# Altium schematic sheet Input_power.SchDoc: Input_Power
size A4; DrawnBy: Project_Vega_Team; Revision: 1; SheetNumber: 2; SheetTotal: 7
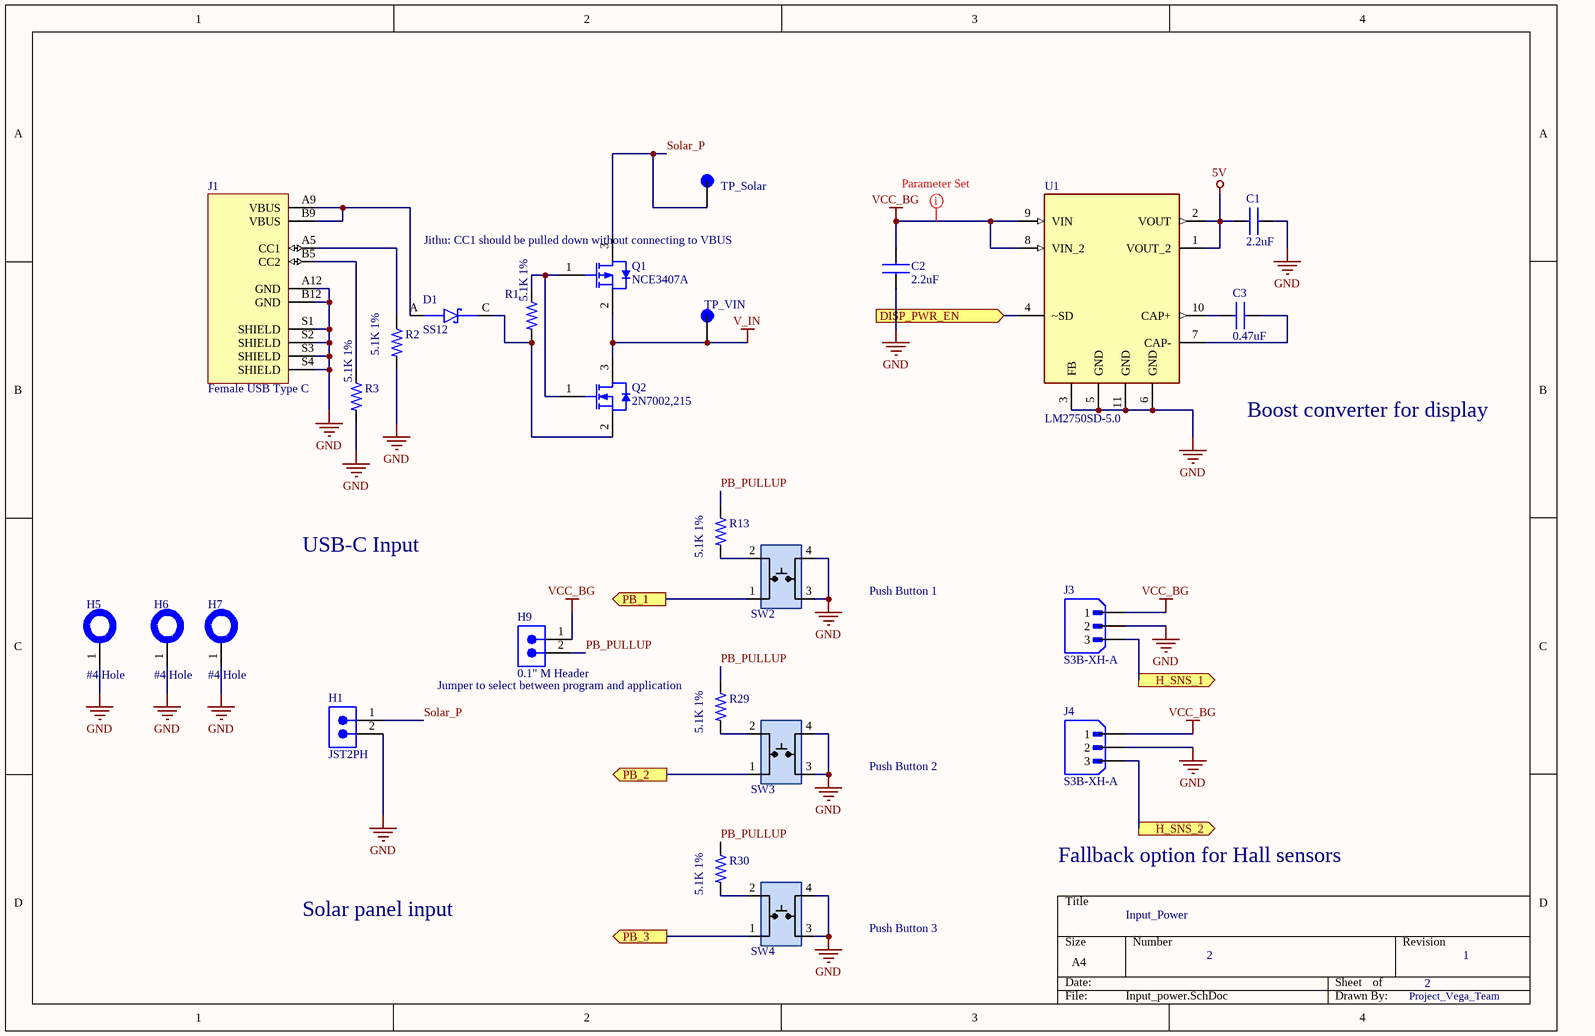
[diagram p0: Input_power.SchDoc]

## Parts
C1  2.2uF  [CAP_0603_1MM]
C2  2.2uF  [CAP_0603_1MM]
C3  0.47uF  [CAP_0603_1MM]
D1  SS12  [DIOM4427X270N]
H1  JST2PH  [JST_B2B-PH-K-S(LF)(SN)]
H5  #4 Hole  [HOLE_#4]  (no BOM)
H6  #4 Hole  [HOLE_#4]  (no BOM)
H7  #4 Hole  [HOLE_#4]  (no BOM)
H9  0.1" M Header  [2-PIN_MALE_HEADER_01-IN]
J1  Female USB Type C  [GCT_USB4125-GF-A_REVA2]
J3  S3B-XH-A  [JST_S3B-XH-A]
J4  S3B-XH-A  [JST_S3B-XH-A]
Q1  NCE3407A  [NCEP-SOT23-3_M]
Q2  2N7002,215  [NXP-SOT23-3_V]
R1  5.1K 1%  [RES_0603_1608X06]
R2  5.1K 1%  [RES_0603_1608X06]
R3  5.1K 1%  [RES_0603_1608X06]
R13  5.1K 1%  [RES_0603]
R29  5.1K 1%  [RES_0603]
R30  5.1K 1%  [RES_0603]
SW2  TL3305AF160QG  [Switch_JLC]  (value not drawn)
SW3  TL3305AF160QG  [Switch_JLC]  (value not drawn)
SW4  TL3305AF160QG  [Switch_JLC]  (value not drawn)
TP_Solar  Test_point  [1]  (value not drawn)
TP_VIN  Test_point  [1]  (value not drawn)
U1  LM2750SD-5.0  [LM2750_DFN300X300X80-11N]

## Ports
DISP_PWR_EN (in, see Principal_Node[2D]), H_SNS_1 (out, see Principal_Node[2D]), H_SNS_2 (out, see Principal_Node[2D]), PB_1 (out, see Principal_Node[2C]), PB_2 (out, see Principal_Node[2C]), PB_3 (out, see Principal_Node[2D])

## Nets
5V: C1.2 U1.1(VOUT_2) U1.2(VOUT)
GND: C1.1 C2.1 H1.2 H5.1 H6.1 H7.1 J1.A12(GND) J1.B12(GND) J1.S1(SHIELD) J1.S2(SHIELD) J1.S3(SHIELD) J1.S4(SHIELD) J3.2 J4.2 R2.2 R3.2 SW2.3 SW2.4 SW3.3 SW3.4 SW4.3 SW4.4 U1.3(FB) U1.5(GND) U1.6(GND) U1.11(GND)
V_IN: Q1.2(SOURCE) Q2.3(D) TP_VIN.TP(VIN)
VCC_BG: C2.2 H9.1 J3.1 J4.1 U1.8(VIN_2) U1.9(VIN)
DISP_PWR_EN: U1.4(~SD) ; port DISP_PWR_EN
H_SNS_1: J3.3 ; port H_SNS_1
H_SNS_2: J4.3 ; port H_SNS_2
PB_1: SW2.1 ; port PB_1
PB_2: SW3.1 ; port PB_2
PB_3: SW4.1 ; port PB_3
PB_PULLUP: H9.2 R13.1 R29.1 R30.1
Solar_P: H1.1 Q1.3(DRAIN) TP_Solar.TP(Solar)
NetC3_1: C3.1 U1.7(CAP-)
NetC3_2: C3.2 U1.10(CAP+)
NetD1_A: D1.A J1.A9(VBUS) J1.B9(VBUS)
NetD1_C: D1.C Q2.2(S) R1.2
NetJ1_A5: J1.A5(CC1) R2.1
NetJ1_B5: J1.B5(CC2) R3.1
NetQ1_1: Q1.1(GATE) Q2.1(G) R1.1
NetR13_2: R13.2 SW2.2
NetR29_2: R29.2 SW3.2
NetR30_2: R30.2 SW4.2

## Layout directives
rule Width Constraint [Pref Width = 20mil    Min Width = 6mil    Max Width = 20mil]: VCC_BG

## Notes on the sheet
- (near Q1) Jithu: CC1 should be pulled down without connecting to VBUS
- Boost converter for display
- USB-C Input
- Push Button 1
- (near R29) Jumper to select between program and application
- Push Button 2
- Solar panel input
- Fallback option for Hall sensors
- Push Button 3

## Library data of the parts
C1 = GRM188R61A226ME15D: Manufacturer: Murata; Capacitance: 22 uF; Voltage Rating DC: 10 VDC; Dielectric: X5R; Tolerance: 20 %; Brand: Murata Electronics; Type: Voltage and Temperature Derating Recommended Product; Unit Weight: 0.000222 oz; Supplier 1: Digi-Key; Supplier Part Number 1: 490-10476-1-ND; Manufacturer Part Number: GRM188R61A226ME15D; Stock 1: 849458; Pricing 1: 1=0.33, 10=0.226, 50=0.1506, 100=0.1279, 500=0.0903, 1000=0.079 (USD); Product Category: Multilayer Ceramic Capacitors MLCC - SMD/SMT; RoHS: True; Case Code - in: 0603; Case Code - mm: 1608; Height: 0.8 mm; Maximum Operating Temperature: + 85 C; Minimum Operating Temperature: - 55 C; Product: General Type MLCCs; Series: GRM; Packaging: Reel; Length: 1.6 mm; Package / Case: 0603 (1608 metric); Factory Pack Quantity: 4000; Termination Style: SMD/SMT; Width: 0.8 mm; ComponentLink1URL: http://www.farnell.com/datasheets/2047978.pdf?src-supplier=Element14; ComponentLink1Description: http://www.farnell.com/datasheets/2047978.pdf?src-supplier=Element14
C2 C3 = GRM188R61A226ME15D: CAP CER 22UF 10V X5R 0603; Manufacturer: Murata; Voltage Rating DC: 10 VDC; Tolerance: 20 %; Brand: Murata Electronics; Type: Voltage and Temperature Derating Recommended Product; Unit Weight: 0.000222 oz; Supplier 1: Digi-Key; Supplier Part Number 1: 490-10476-1-ND; Manufacturer Part Number: GRM188R61A226ME15D; Stock 1: 849458; Pricing 1: 1=0.33, 10=0.226, 50=0.1506, 100=0.1279, 500=0.0903, 1000=0.079 (USD); Product Category: Multilayer Ceramic Capacitors MLCC - SMD/SMT; RoHS: True; Capacitance: 22 uF; Dielectric: X5R; Case Code - in: 0603; Case Code - mm: 1608; Height: 0.8 mm; Maximum Operating Temperature: + 85 C; Minimum Operating Temperature: - 55 C; Product: General Type MLCCs; Series: GRM; Packaging: Reel; Length: 1.6 mm; Package / Case: 0603 (1608 metric); Factory Pack Quantity: 4000; Termination Style: SMD/SMT; Width: 0.8 mm; ComponentLink1URL: http://www.farnell.com/datasheets/2047978.pdf?src-supplier=Element14; ComponentLink1Description: http://www.farnell.com/datasheets/2047978.pdf?src-supplier=Element14
D1 = SS12: DIODE SCHOTTKY 20V 1A DO214AC; MF: Klein Tools,; SnapEDA_Link: https://www.snapeda.com/parts/SS12/Klein%20Tools,%20Inc./view-part/2177644/?ref=snap; MP: SS12; Check_prices: https://www.snapeda.com/parts/SS12/Klein%20Tools,%20Inc./view-part/2177644/?ref=eda; Price: None; Purchase-URL: https://pricing.snapeda.com/search/part/SS12/?ref=eda; Value: *; Availability: Good; Package: DO-214AC-214 ON Semiconductor; ComponentLink1Description: digikey; ComponentLink1URL: https://www.digikey.com/en/products/detail/onsemi/SS12/1049858
H1 = JST2PH: Connector Header Through Hole 2 position 0.079" (2.00mm); Manufacturer: JST; Manufacturer Part Number: B2B-PH-K-S; Supplier: Digi-Key; Supplier Part Number: 455-1704-ND; RoHS: Yes; Category: Connectors; Stock: 1077617; Pricing: 1=0.19, 10=0.147, 100=0.1088, 500=0.09006, 1000=0.0788, 5000=0.06754, 10000=0.06567 (USD); ComponentLink1URL: https://datasheet.ciiva.com/6905/phseries-6905929.pdf?src-supplier=Digi-Key; ComponentLink1Description: https://datasheet.ciiva.com/6905/phseries-6905929.pdf?src-supplier=Digi-Key
H5-H7 = HOLE_#4
H9 = PRPC002SAAN-RC: CONN HEADER VERT 2POS 2.54MM; Manufacturer: Sullins; Connector Type: Header, Unshrouded, Breakaway; Number of Positions: 2; Number of Positions Loaded: All; Pitch: 0.100" (2.54mm); Online Catalog: 0.100" (2.54mm) Pitch Connector Headers; Other Names: S9510E-02  S9510E-02-ND; Supplier 1: Digi-Key; Manufacturer Part Number: PRPC002SAAN-RC; Stock 1: 42739; Pricing 1: 1=0.08, 10=0.073, 25=0.054, 50=0.0464, 100=0.0449, 250=0.0387, 500=0.0372 (USD); Standard Package: 1; Category: Connectors, Interconnects; Family: Rectangular Connectors - Headers, Male Pins; Series: -; Packaging: Bulk; Contact Type: Male Pin; Number of Rows: 1; Row Spacing: -; Contact Mating Length: 0.230" (5.84mm); Mounting Type: Through Hole; Termination: Solder; Fastening Type: -; Features: -; Contact Finish: Gold; Contact Finish Thickness: Flash; Color: Black; ComponentLink1URL: https://media.digikey.com/PDF/Data%20Sheets/Sullins%20PDFs/xRxCzzzSxxN-RC_ST_11635-B.pdf?src-supplier=Digi-Key; ComponentLink1Description: https://media.digikey.com/PDF/Data%20Sheets/Sullins%20PDFs/xRxCzzzSxxN-RC_ST_11635-B.pdf?src-supplier=Digi-Key; Supplier Part Number 1: S1011EC-02-ND
J1 = USB-C Power Connector: USB Connector, 24 Contact(s), Female, Right Angle, Solder Terminal, Locking, Receptacle; Manufacturer Part Number: USB4125-GF-A_REVA2; Manufacturer: Global Connector Technology; Package: None; Availability: Unavailable; Value: *; Price: None; Supplier: Digikey; Supplier Part Number: 2073-USB4125-GF-ACT-ND; RoHS: No; Category: Connectors; Stock: 9026; Pricing: 1=0.8, 10=0.609, 25=0.5472, 50=0.505, 100=0.4667, 250=0.42128, 500=0.3905, 1000=0.36254, 2000=0.3372, 3000=0.32348, 5000=0.3073, 7000=0.29727, 10000=0.28716, 25000=0.2675 (USD); Pins: 6; Gender: Receptacle; Orientation: Horizontal; ComponentLink1URL: https://datasheet.octopart.com/USB4125-GF-A-Global-Connector-Technology-datasheet-148864632.pdf?src-supplier=Future+Electronics; ComponentLink1Description: https://datasheet.octopart.com/USB4125-GF-A-Global-Connector-Technology-datasheet-148864632.pdf?src-supplier=Future+Electronics; ComponentLink2URL: https://datasheet.octopart.com/USB4125-GF-A-GCT-datasheet-166929326.pdf?src-supplier=SOS+electronic; ComponentLink2Description: https://datasheet.octopart.com/USB4125-GF-A-GCT-datasheet-166929326.pdf?src-supplier=SOS+electronic
J3 J4 = S3B-XH-A: Board Connector, 3 Contact(s), 1 Row(s), Male, Right Angle, Solder Terminal; Manufacturer: JST; MF: JST Sales; MP: B3B-XH-A(LF)(SN); Number of Contacts: 3; SnapEDA_Link: https://www.snapeda.com/parts/B3B-XH-A(LF)(SN)/JST+Sales+America+Inc./view-part/?ref=snap; Package: None; Value: *; Check_prices: https://www.snapeda.com/parts/B3B-XH-A(LF)(SN)/JST+Sales+America+Inc./view-part/?ref=eda; Supplier 1: Digikey; Supplier Part Number 1: 455-S3B-XH-A-ND; Supplier: Digikey; Supplier Part Number: 455-S3B-XH-A-ND; Manufacturer Part Number: S3B-XH-A; RoHS: Yes; Category: FFC / FPC; Stock: 168930; Pricing: 1=0.19, 10=0.146, 100=0.1118, 500=0.09304, 1000=0.08614, 5000=0.07248, 10000=0.06971 (USD); Contact Plating: Tin; Contact Material: Brass; Number of Rows: 1; Termination: Through Hole; Gender: Male; Series: XH; Reach SVHC Compliant: No; ComponentLink1URL: https://datasheet.ciiva.com/8052/621903-8052222.pdf?src-supplier=Element14; ComponentLink1Description: https://datasheet.ciiva.com/8052/621903-8052222.pdf?src-supplier=Element14
Q1 = CMP-013-00018-3: P-Channel Enhancement Mode Power MOSFET, 30 V, 4.3 A, - 55 to 150 degC, 3-Pin SOT23, RoHS, Tape and Reel; Manufacturer: NCE Power; Datasheet Version: Rev. 1.1, 07/2014; Case/Package: SOT23-3; Mounting Technology: SM; Datasheet URL: http://www.ncepower.com/Upload/MOSFET/mos1/55vpmos/NCE3407Adatasheet-17275285683.pdf; Package Reference: SOT23-3; Package Description: 3-Pin Small Outline Transistor, Body 2.9 x 1.3 mm, Pitch 0.95 mm; RoHS Compliant: Unknown
Q2 = CMP-013-00011-4: N-channel Trench MOSFET, 60 V, 300 mA, -65 to 150 degC, 3-Pin SOT-23 (TO-236AB), RoHS, Tape and Reel; Manufacturer: NXP Semiconductors; Elements: 1; Power: 830mW; Max Dual Supply Voltage: 60V; Rds On Max: 5Ohm; Package Version: Feb-16; Nominal Vgs: 2V; Input Capacitance: 50pF; RoHS Compliant: True; Datasheet URL: http://www.nxp.com/documents/data_sheet/2N7002.pdf; Packaging: TapeandReel; Case/Package: TO-236-3; Package Reference: SOT23-3; Max Operating Temperature: 150°C; Pins: 8; Mounting Technology: SM; Package Quantity: 1; Datasheet Version: Rev. 7, 09/2011; Nominal Dual Supply Voltage: 60V; Min Operating Temperature: -65°C; Package Description: 3-Pin Small Outline Transistor, Body 1.3 x 2.9 mm, Pitch 0.95 mm; Vds Max: 60V
R1 R3 R13 R29 R30 = RC0603FR-07316KL: SMD Chip Resistor, 5.1KOhm, ± 1%, 100 mW, 0603 [1608 Metric], Thick Film, General Purpose; Manufacturer: Yageo; Value: 316kR; Power Rating: 100mW; Voltage Rating: 50V; Temperature Coefficient: 100ppm/°C; Supplier: Digikey; Supplier Part Number: 311-316KHRCT-ND; Manufacturer Part Number: RC0603FR-07316KL; RoHS: Yes; Category: Chip SMD Resistors; Stock: 149463; Pricing: 1=0.1, 10=0.019, 50=0.0112, 100=0.0093, 500=0.00622, 1000=0.00532 (USD); Mounting Technology: Surface Mount; Case/Package: 0603; Case Code (Imperial): 0603; Case Code (Metric): 1608; Min Operating Temperature: -55°C; Max Operating Temperature: 155°C; Tolerance: 1%; Packaging: Tape and Reel; Termination: SMD/SMT; Number of Terminations: 2; Max Power Dissipation: 100mW; Voltage Rating (DC): 50V; Features: Moisture Resistant; Series: RC; Lead Free: Lead Free; RoHS Compliant: Yes; ComponentLink1URL: https://datasheet.ciiva.com/2454/pyu-r-int-thick-7-2454966.pdf?src-supplier=Digikey; ComponentLink1Description: https://datasheet.ciiva.com/2454/pyu-r-int-thick-7-2454966.pdf?src-supplier=Digikey; ComponentLink2URL: https://datasheet.ciiva.com/2454/pyu-r-int-thick-7-2454967.pdf?src-supplier=Digikey; ComponentLink2Description: https://datasheet.ciiva.com/2454/pyu-r-int-thick-7-2454967.pdf?src-supplier=Digikey; ComponentLink3URL: https://datasheet.ciiva.com/2454/pyu-r-int-thick-7-2454968.pdf?src-supplier=Digikey; ComponentLink3Description: https://datasheet.ciiva.com/2454/pyu-r-int-thick-7-2454968.pdf?src-supplier=Digikey
R2 = RC0603FR-07316KL: SMD Chip Resistor, 316 kOhm, ± 1%, 100 mW, 0603 [1608 Metric], Thick Film, General Purpose; Manufacturer: Yageo; Value: 316kR; Power Rating: 100mW; Voltage Rating: 50V; Temperature Coefficient: 100ppm/°C; Supplier: Digikey; Supplier Part Number: 311-316KHRCT-ND; Manufacturer Part Number: RC0603FR-07316KL; RoHS: Yes; Category: Chip SMD Resistors; Stock: 149463; Pricing: 1=0.1, 10=0.019, 50=0.0112, 100=0.0093, 500=0.00622, 1000=0.00532 (USD); Mounting Technology: Surface Mount; Case/Package: 0603; Case Code (Imperial): 0603; Case Code (Metric): 1608; Min Operating Temperature: -55°C; Max Operating Temperature: 155°C; Tolerance: 1%; Packaging: Tape and Reel; Termination: SMD/SMT; Number of Terminations: 2; Max Power Dissipation: 100mW; Voltage Rating (DC): 50V; Features: Moisture Resistant; Series: RC; Lead Free: Lead Free; RoHS Compliant: Yes; ComponentLink1URL: https://datasheet.ciiva.com/2454/pyu-r-int-thick-7-2454966.pdf?src-supplier=Digikey; ComponentLink1Description: https://datasheet.ciiva.com/2454/pyu-r-int-thick-7-2454966.pdf?src-supplier=Digikey; ComponentLink2URL: https://datasheet.ciiva.com/2454/pyu-r-int-thick-7-2454967.pdf?src-supplier=Digikey; ComponentLink2Description: https://datasheet.ciiva.com/2454/pyu-r-int-thick-7-2454967.pdf?src-supplier=Digikey; ComponentLink3URL: https://datasheet.ciiva.com/2454/pyu-r-int-thick-7-2454968.pdf?src-supplier=Digikey; ComponentLink3Description: https://datasheet.ciiva.com/2454/pyu-r-int-thick-7-2454968.pdf?src-supplier=Digikey
SW2-SW4 = SW_Push_Button_JLC: Tactile Switch SPST-NO Top Actuated Surface Mount; MFR Part #: KH-4.5X4.5X4.3H-STM; LCSC Part#: C2837550; Type: Extended; DataSheet: https://datasheet.lcsc.com/lcsc/2106081532_Shenzhen-Kinghelm-Elec-KH-4.5X4.5X4.3H-STM_C2837550.pdf
TP_Solar TP_VIN = Test_point: SMT Test Point- Mininature-1000 pc Reels; MP: 5019; MF: Keystone Electronics; Value: *; Availability: In Stock; Purchase-URL: https://pricing.snapeda.com/search/part/5019/?ref=eda; Package: None; Price: None
U1 = LM2750SD-5.0: Voltage Regulators - Switching Regulators Reg Switch Capacitor Boost Reg; Manufacturer: TI National Semiconductor; Manufacturer Part Number: LM2750SD-5.0/NOPB; MP: LM2750SD-5-0; Output Voltage: 5V; Number of Outputs: 1; Output Current: 120mA; Frequency: 1.7MHz; Max Supply Voltage: 5.6V; Min Supply Voltage: 2.7V; Efficiency: 87%; Operating Supply Current: 5mA; Min Output Voltage: 4.8V; Output Type: Fixed; Package: None; Price: None; Value: *; Availability: Unavailable; Supplier 1: Digikey; Supplier Part Number 1: LM2750SD-5.0/NOPBCT-ND; Supplier: Digikey; Supplier Part Number: LM2750SD-5.0/NOPBCT-ND; RoHS: Yes; Category: Voltage Regulators - Switching; Stock: 1468; Pricing: 1=2.34, 10=1.674, 25=1.5068, 100=1.3227, 250=1.23504, 500=1.18214 (USD); Mounting Technology: Surface Mount; Pins: 10; Min Operating Temperature: -40°C; Max Operating Temperature: 85°C; Packaging: Tape and Reel; Max Output current: 120mA; Min Input Voltage: 2.7V; Switching Frequency: 1.7MHz; Nominal Output Voltage: 5V; Max Output Voltage: 5V; Termination: SMD/SMT; Quiescent Current: 5mA; Topology: Boost; Series: LM2750; Length: 3mm; Width: 3mm; Height: 0.8mm; Thickness: 750um; Radiation Hardening: No; Reach SVHC Compliant: No; Lead Free: Lead Free; RoHS Compliant: Yes; ComponentLink1URL: https://datasheet.ciiva.com/5699/1781827-5699312.pdf?src-supplier=Farnell; ComponentLink1Description: https://datasheet.ciiva.com/5699/1781827-5699312.pdf?src-supplier=Farnell; ComponentLink2URL: https://datasheet.ciiva.com/6598/lm2750-6598374.pdf?src-supplier=Digikey; ComponentLink2Description: https://datasheet.ciiva.com/6598/lm2750-6598374.pdf?src-supplier=Digikey; ComponentLink3URL: https://datasheet.ciiva.com/7994/59930-7994364.pdf?src-supplier=Element14; ComponentLink3Description: https://datasheet.ciiva.com/7994/59930-7994364.pdf?src-supplier=Element14